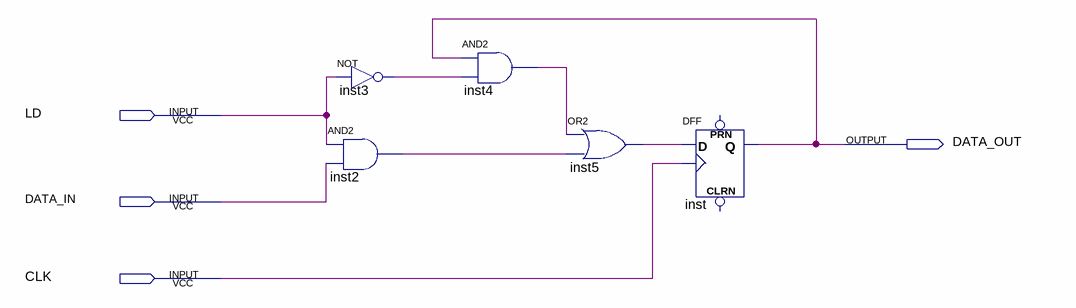
[diagram p0: schematic sheet]
// Quartus schematic GP_Register_1bit.bdf as structural Verilog: 5 symbols, 4 pins
module GP_Register_1bit (
  input  LD,
  input  DATA_IN,
  input  CLK,
  output DATA_OUT
);

  wire inst2_out, inst3_out, inst4_out, inst5_out;

  not inst3 (inst3_out, LD);
  and inst2 (inst2_out, LD, DATA_IN);
  and inst4 (inst4_out, DATA_OUT, inst3_out);
  or inst5 (inst5_out, inst4_out, inst2_out);
  DFF inst (.CLK(CLK), .D(inst5_out), .Q(DATA_OUT));  // open: CLRN, PRN
endmodule
